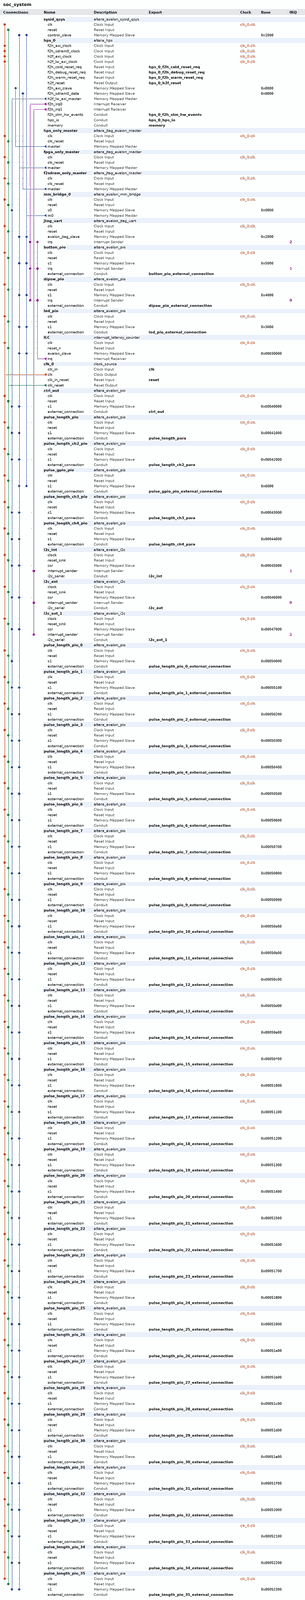
[diagram p0: system contents, whole]
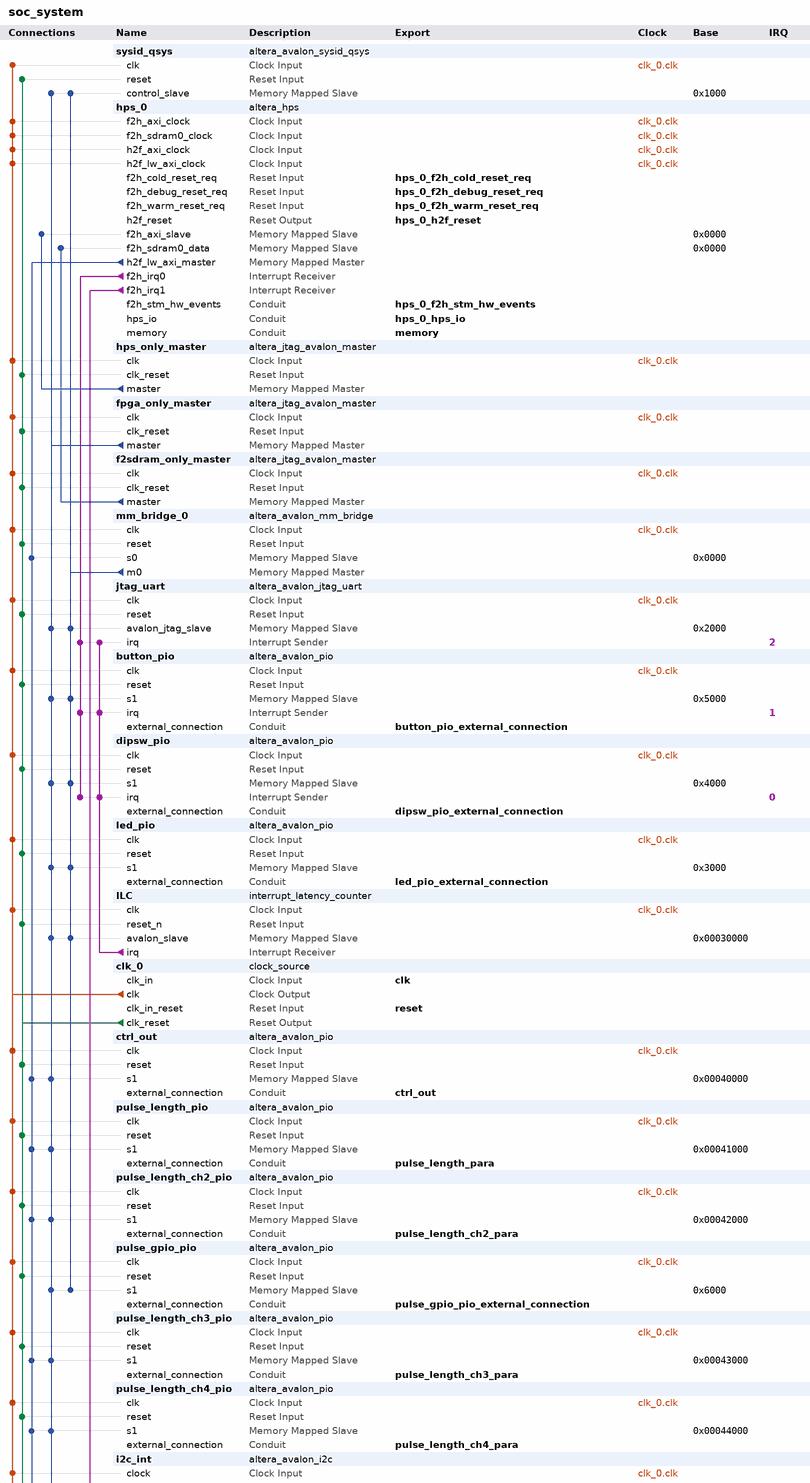
[diagram p1: system contents, upper part]
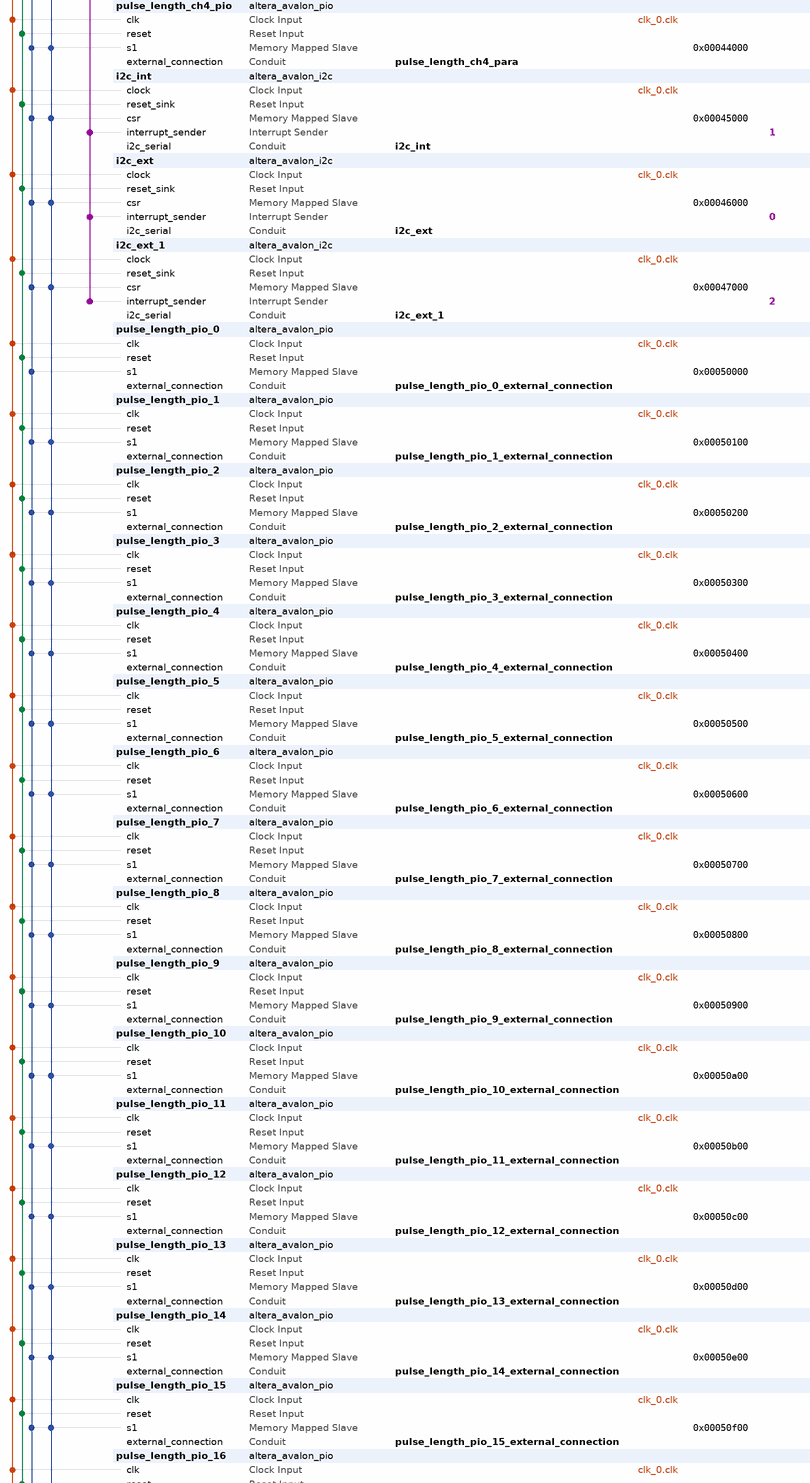
[diagram p2: system contents, middle part]
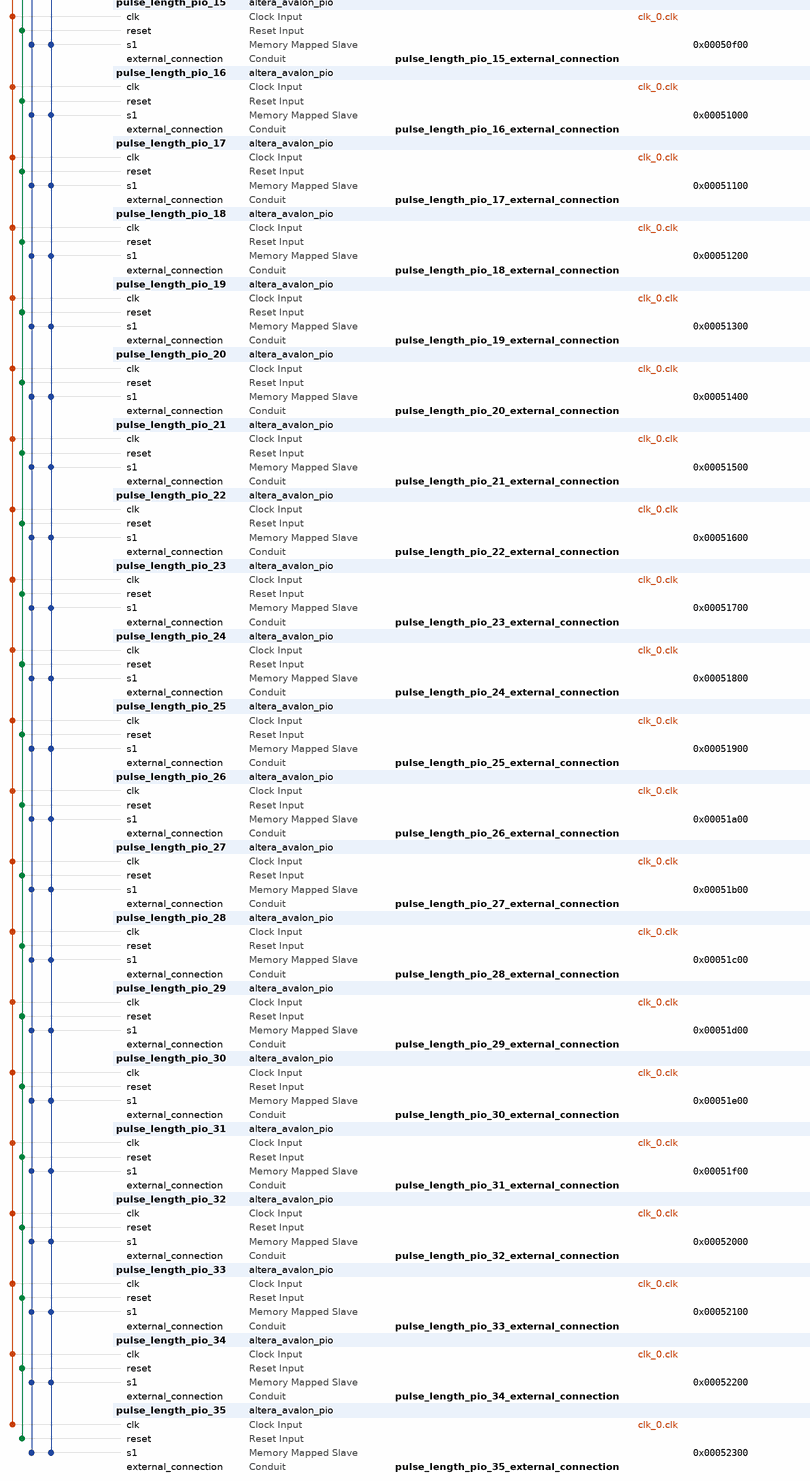
[diagram p3: system contents, lower part]
# Platform Designer (Qsys) system soc_system, Cyclone V 5CSEBA6U23I7
# Parameters at their usual value, and those the tool derives, are not listed.
package require -exact qsys 18.1
create_system soc_system
set_project_property DEVICE_FAMILY {Cyclone V}
set_project_property DEVICE 5CSEBA6U23I7

add_instance sysid_qsys altera_avalon_sysid_qsys 18.1
set_instance_parameter_value sysid_qsys id -1395322110

add_instance hps_0 altera_hps 18.1
set_instance_parameter_value hps_0 EMAC1_Mode RGMII
set_instance_parameter_value hps_0 EMAC1_PinMuxing {HPS I/O Set 0}
set_instance_parameter_value hps_0 F2SCLK_COLDRST_Enable true
set_instance_parameter_value hps_0 F2SCLK_DBGRST_Enable true
set_instance_parameter_value hps_0 F2SCLK_WARMRST_Enable true
set_instance_parameter_value hps_0 F2SDRAM_Type {Avalon-MM Bidirectional}
set_instance_parameter_value hps_0 F2SDRAM_Width 256
set_instance_parameter_value hps_0 F2SINTERRUPT_Enable true
set_instance_parameter_value hps_0 F2S_Width 2
set_instance_parameter_value hps_0 FPGA_PERIPHERAL_OUTPUT_CLOCK_FREQ_EMAC0_GTX_CLK 100
set_instance_parameter_value hps_0 FPGA_PERIPHERAL_OUTPUT_CLOCK_FREQ_EMAC0_MD_CLK 100.0
set_instance_parameter_value hps_0 FPGA_PERIPHERAL_OUTPUT_CLOCK_FREQ_EMAC1_GTX_CLK 100
set_instance_parameter_value hps_0 FPGA_PERIPHERAL_OUTPUT_CLOCK_FREQ_EMAC1_MD_CLK 100.0
set_instance_parameter_value hps_0 HPS_PROTOCOL DDR3
set_instance_parameter_value hps_0 I2C0_Mode I2C
set_instance_parameter_value hps_0 I2C0_PinMuxing {HPS I/O Set 0}
set_instance_parameter_value hps_0 I2C1_Mode I2C
set_instance_parameter_value hps_0 I2C1_PinMuxing {HPS I/O Set 0}
set_instance_parameter_value hps_0 LWH2F_Enable true
set_instance_parameter_value hps_0 MEM_BANKADDR_WIDTH 3
set_instance_parameter_value hps_0 MEM_CLK_FREQ 400.0
set_instance_parameter_value hps_0 MEM_COL_ADDR_WIDTH 10
set_instance_parameter_value hps_0 MEM_DQ_WIDTH 32
set_instance_parameter_value hps_0 MEM_DRV_STR RZQ/6
set_instance_parameter_value hps_0 MEM_ROW_ADDR_WIDTH 15
set_instance_parameter_value hps_0 MEM_RTT_NOM RZQ/6
set_instance_parameter_value hps_0 MEM_RTT_WR {Dynamic ODT off}
set_instance_parameter_value hps_0 MEM_TCL 7
set_instance_parameter_value hps_0 MEM_TFAW_NS 37.5
set_instance_parameter_value hps_0 MEM_TRAS_NS 35.0
set_instance_parameter_value hps_0 MEM_TRCD_NS 13.75
set_instance_parameter_value hps_0 MEM_TRFC_NS 300.0
set_instance_parameter_value hps_0 MEM_TRP_NS 13.75
set_instance_parameter_value hps_0 MEM_VENDOR Other
set_instance_parameter_value hps_0 MEM_WTCL 7
set_instance_parameter_value hps_0 QSPI_Mode N/A
set_instance_parameter_value hps_0 QSPI_PinMuxing Unused
set_instance_parameter_value hps_0 REF_CLK_FREQ 25.0
set_instance_parameter_value hps_0 S2FCLK_USER2CLK 4
set_instance_parameter_value hps_0 S2F_Width 2
set_instance_parameter_value hps_0 SDIO_Mode {4-bit Data}
set_instance_parameter_value hps_0 SDIO_PinMuxing {HPS I/O Set 0}
set_instance_parameter_value hps_0 SPIM1_Mode {Single Slave Select}
set_instance_parameter_value hps_0 SPIM1_PinMuxing {HPS I/O Set 0}
set_instance_parameter_value hps_0 STM_Enable true
set_instance_parameter_value hps_0 TIMING_BOARD_AC_SKEW 0.02
set_instance_parameter_value hps_0 TIMING_BOARD_AC_TO_CK_SKEW 0.0
set_instance_parameter_value hps_0 TIMING_BOARD_DQ_TO_DQS_SKEW 0.0
set_instance_parameter_value hps_0 TIMING_BOARD_MAX_CK_DELAY 0.6
set_instance_parameter_value hps_0 TIMING_BOARD_MAX_DQS_DELAY 0.6
set_instance_parameter_value hps_0 TIMING_BOARD_SKEW_BETWEEN_DQS 0.02
set_instance_parameter_value hps_0 TIMING_BOARD_SKEW_CKDQS_DIMM_MAX 0.01
set_instance_parameter_value hps_0 TIMING_BOARD_SKEW_CKDQS_DIMM_MIN -0.01
set_instance_parameter_value hps_0 TIMING_BOARD_SKEW_WITHIN_DQS 0.02
set_instance_parameter_value hps_0 TIMING_TDH 125
set_instance_parameter_value hps_0 TIMING_TDQSCK 400
set_instance_parameter_value hps_0 TIMING_TDQSQ 120
set_instance_parameter_value hps_0 TIMING_TDS 50
set_instance_parameter_value hps_0 TIMING_TIH 250
set_instance_parameter_value hps_0 TIMING_TIS 175
set_instance_parameter_value hps_0 TIMING_TQSH 0.38
set_instance_parameter_value hps_0 UART0_Mode {No Flow Control}
set_instance_parameter_value hps_0 UART0_PinMuxing {HPS I/O Set 0}
set_instance_parameter_value hps_0 USB1_Mode SDR
set_instance_parameter_value hps_0 USB1_PinMuxing {HPS I/O Set 0}
set_instance_parameter_value hps_0 desired_cfg_clk_mhz 100.0
set_instance_parameter_value hps_0 desired_qspi_clk_mhz 370.0

add_instance hps_only_master altera_jtag_avalon_master 18.1

add_instance fpga_only_master altera_jtag_avalon_master 18.1

add_instance f2sdram_only_master altera_jtag_avalon_master 18.1

add_instance mm_bridge_0 altera_avalon_mm_bridge 18.1
set_instance_parameter_value mm_bridge_0 ADDRESS_UNITS SYMBOLS
set_instance_parameter_value mm_bridge_0 ADDRESS_WIDTH 10
set_instance_parameter_value mm_bridge_0 DATA_WIDTH 32
set_instance_parameter_value mm_bridge_0 MAX_PENDING_RESPONSES 4
set_instance_parameter_value mm_bridge_0 USE_AUTO_ADDRESS_WIDTH 1

add_instance jtag_uart altera_avalon_jtag_uart 18.1
set_instance_parameter_value jtag_uart allowMultipleConnections true
set_instance_parameter_value jtag_uart simInteractiveOptions INTERACTIVE_ASCII_OUTPUT

add_instance button_pio altera_avalon_pio 18.1
set_instance_parameter_value button_pio bitClearingEdgeCapReg true
set_instance_parameter_value button_pio captureEdge true
set_instance_parameter_value button_pio direction Input
set_instance_parameter_value button_pio edgeType FALLING
set_instance_parameter_value button_pio generateIRQ true
set_instance_parameter_value button_pio irqType EDGE
set_instance_parameter_value button_pio width 2

add_instance dipsw_pio altera_avalon_pio 18.1
set_instance_parameter_value dipsw_pio bitClearingEdgeCapReg true
set_instance_parameter_value dipsw_pio captureEdge true
set_instance_parameter_value dipsw_pio direction Input
set_instance_parameter_value dipsw_pio edgeType ANY
set_instance_parameter_value dipsw_pio generateIRQ true
set_instance_parameter_value dipsw_pio irqType EDGE
set_instance_parameter_value dipsw_pio width 4

add_instance led_pio altera_avalon_pio 18.1
set_instance_parameter_value led_pio direction Output
set_instance_parameter_value led_pio resetValue 127
set_instance_parameter_value led_pio width 7

add_instance ILC interrupt_latency_counter 18.1

add_instance clk_0 clock_source 18.1
set_instance_parameter_value clk_0 clockFrequency 50000000

add_instance ctrl_out altera_avalon_pio 18.1
set_instance_parameter_value ctrl_out direction Output
set_instance_parameter_value ctrl_out width 32

add_instance pulse_length_pio altera_avalon_pio 18.1
set_instance_parameter_value pulse_length_pio direction Output
set_instance_parameter_value pulse_length_pio width 32

add_instance pulse_length_ch2_pio altera_avalon_pio 18.1
set_instance_parameter_value pulse_length_ch2_pio direction Output
set_instance_parameter_value pulse_length_ch2_pio width 32

add_instance pulse_gpio_pio altera_avalon_pio 18.1
set_instance_parameter_value pulse_gpio_pio direction Output
set_instance_parameter_value pulse_gpio_pio resetValue 127
set_instance_parameter_value pulse_gpio_pio width 7

add_instance pulse_length_ch3_pio altera_avalon_pio 18.1
set_instance_parameter_value pulse_length_ch3_pio direction Output
set_instance_parameter_value pulse_length_ch3_pio width 32

add_instance pulse_length_ch4_pio altera_avalon_pio 18.1
set_instance_parameter_value pulse_length_ch4_pio direction Output
set_instance_parameter_value pulse_length_ch4_pio width 32

add_instance i2c_int altera_avalon_i2c 18.1
set_instance_parameter_value i2c_int FIFO_DEPTH 32

add_instance i2c_ext altera_avalon_i2c 18.1
set_instance_parameter_value i2c_ext FIFO_DEPTH 32

add_instance i2c_ext_1 altera_avalon_i2c 18.1
set_instance_parameter_value i2c_ext_1 FIFO_DEPTH 32

add_instance pulse_length_pio_0 altera_avalon_pio 18.1
set_instance_parameter_value pulse_length_pio_0 direction Output
set_instance_parameter_value pulse_length_pio_0 width 32

add_instance pulse_length_pio_1 altera_avalon_pio 18.1
set_instance_parameter_value pulse_length_pio_1 direction Output
set_instance_parameter_value pulse_length_pio_1 width 32

add_instance pulse_length_pio_2 altera_avalon_pio 18.1
set_instance_parameter_value pulse_length_pio_2 direction Output
set_instance_parameter_value pulse_length_pio_2 width 32

add_instance pulse_length_pio_3 altera_avalon_pio 18.1
set_instance_parameter_value pulse_length_pio_3 direction Output
set_instance_parameter_value pulse_length_pio_3 width 32

add_instance pulse_length_pio_4 altera_avalon_pio 18.1
set_instance_parameter_value pulse_length_pio_4 direction Output
set_instance_parameter_value pulse_length_pio_4 width 32

add_instance pulse_length_pio_5 altera_avalon_pio 18.1
set_instance_parameter_value pulse_length_pio_5 direction Output
set_instance_parameter_value pulse_length_pio_5 width 32

add_instance pulse_length_pio_6 altera_avalon_pio 18.1
set_instance_parameter_value pulse_length_pio_6 direction Output
set_instance_parameter_value pulse_length_pio_6 width 32

add_instance pulse_length_pio_7 altera_avalon_pio 18.1
set_instance_parameter_value pulse_length_pio_7 direction Output
set_instance_parameter_value pulse_length_pio_7 width 32

add_instance pulse_length_pio_8 altera_avalon_pio 18.1
set_instance_parameter_value pulse_length_pio_8 direction Output
set_instance_parameter_value pulse_length_pio_8 width 32

add_instance pulse_length_pio_9 altera_avalon_pio 18.1
set_instance_parameter_value pulse_length_pio_9 direction Output
set_instance_parameter_value pulse_length_pio_9 width 32

add_instance pulse_length_pio_10 altera_avalon_pio 18.1
set_instance_parameter_value pulse_length_pio_10 direction Output
set_instance_parameter_value pulse_length_pio_10 width 32

add_instance pulse_length_pio_11 altera_avalon_pio 18.1
set_instance_parameter_value pulse_length_pio_11 direction Output
set_instance_parameter_value pulse_length_pio_11 width 32

add_instance pulse_length_pio_12 altera_avalon_pio 18.1
set_instance_parameter_value pulse_length_pio_12 direction Output
set_instance_parameter_value pulse_length_pio_12 width 32

add_instance pulse_length_pio_13 altera_avalon_pio 18.1
set_instance_parameter_value pulse_length_pio_13 direction Output
set_instance_parameter_value pulse_length_pio_13 width 32

add_instance pulse_length_pio_14 altera_avalon_pio 18.1
set_instance_parameter_value pulse_length_pio_14 direction Output
set_instance_parameter_value pulse_length_pio_14 width 32

add_instance pulse_length_pio_15 altera_avalon_pio 18.1
set_instance_parameter_value pulse_length_pio_15 direction Output
set_instance_parameter_value pulse_length_pio_15 width 32

add_instance pulse_length_pio_16 altera_avalon_pio 18.1
set_instance_parameter_value pulse_length_pio_16 direction Output
set_instance_parameter_value pulse_length_pio_16 width 32

add_instance pulse_length_pio_17 altera_avalon_pio 18.1
set_instance_parameter_value pulse_length_pio_17 direction Output
set_instance_parameter_value pulse_length_pio_17 width 32

add_instance pulse_length_pio_18 altera_avalon_pio 18.1
set_instance_parameter_value pulse_length_pio_18 direction Output
set_instance_parameter_value pulse_length_pio_18 width 32

add_instance pulse_length_pio_19 altera_avalon_pio 18.1
set_instance_parameter_value pulse_length_pio_19 direction Output
set_instance_parameter_value pulse_length_pio_19 width 32

add_instance pulse_length_pio_20 altera_avalon_pio 18.1
set_instance_parameter_value pulse_length_pio_20 direction Output
set_instance_parameter_value pulse_length_pio_20 width 32

add_instance pulse_length_pio_21 altera_avalon_pio 18.1
set_instance_parameter_value pulse_length_pio_21 direction Output
set_instance_parameter_value pulse_length_pio_21 width 32

add_instance pulse_length_pio_22 altera_avalon_pio 18.1
set_instance_parameter_value pulse_length_pio_22 direction Output
set_instance_parameter_value pulse_length_pio_22 width 32

add_instance pulse_length_pio_23 altera_avalon_pio 18.1
set_instance_parameter_value pulse_length_pio_23 direction Output
set_instance_parameter_value pulse_length_pio_23 width 32

add_instance pulse_length_pio_24 altera_avalon_pio 18.1
set_instance_parameter_value pulse_length_pio_24 direction Output
set_instance_parameter_value pulse_length_pio_24 width 32

add_instance pulse_length_pio_25 altera_avalon_pio 18.1
set_instance_parameter_value pulse_length_pio_25 direction Output
set_instance_parameter_value pulse_length_pio_25 width 32

add_instance pulse_length_pio_26 altera_avalon_pio 18.1
set_instance_parameter_value pulse_length_pio_26 direction Output
set_instance_parameter_value pulse_length_pio_26 width 32

add_instance pulse_length_pio_27 altera_avalon_pio 18.1
set_instance_parameter_value pulse_length_pio_27 direction Output
set_instance_parameter_value pulse_length_pio_27 width 32

add_instance pulse_length_pio_28 altera_avalon_pio 18.1
set_instance_parameter_value pulse_length_pio_28 direction Output
set_instance_parameter_value pulse_length_pio_28 width 32

add_instance pulse_length_pio_29 altera_avalon_pio 18.1
set_instance_parameter_value pulse_length_pio_29 direction Output
set_instance_parameter_value pulse_length_pio_29 width 32

add_instance pulse_length_pio_30 altera_avalon_pio 18.1
set_instance_parameter_value pulse_length_pio_30 direction Output
set_instance_parameter_value pulse_length_pio_30 width 32

add_instance pulse_length_pio_31 altera_avalon_pio 18.1
set_instance_parameter_value pulse_length_pio_31 direction Output
set_instance_parameter_value pulse_length_pio_31 width 32

add_instance pulse_length_pio_32 altera_avalon_pio 18.1
set_instance_parameter_value pulse_length_pio_32 direction Output
set_instance_parameter_value pulse_length_pio_32 width 32

add_instance pulse_length_pio_33 altera_avalon_pio 18.1
set_instance_parameter_value pulse_length_pio_33 direction Output
set_instance_parameter_value pulse_length_pio_33 width 32

add_instance pulse_length_pio_34 altera_avalon_pio 18.1
set_instance_parameter_value pulse_length_pio_34 direction Output
set_instance_parameter_value pulse_length_pio_34 width 32

add_instance pulse_length_pio_35 altera_avalon_pio 18.1
set_instance_parameter_value pulse_length_pio_35 direction Output
set_instance_parameter_value pulse_length_pio_35 width 32

# connections
add_connection clk_0.clk button_pio.clk clock
add_connection clk_0.clk ctrl_out.clk clock
add_connection clk_0.clk dipsw_pio.clk clock
add_connection clk_0.clk f2sdram_only_master.clk clock
add_connection clk_0.clk fpga_only_master.clk clock
add_connection clk_0.clk hps_0.f2h_axi_clock clock
add_connection clk_0.clk hps_0.f2h_sdram0_clock clock
add_connection clk_0.clk hps_0.h2f_axi_clock clock
add_connection clk_0.clk hps_0.h2f_lw_axi_clock clock
add_connection clk_0.clk hps_only_master.clk clock
add_connection clk_0.clk i2c_ext.clock clock
add_connection clk_0.clk i2c_ext_1.clock clock
add_connection clk_0.clk i2c_int.clock clock
add_connection clk_0.clk ILC.clk clock
add_connection clk_0.clk jtag_uart.clk clock
add_connection clk_0.clk led_pio.clk clock
add_connection clk_0.clk mm_bridge_0.clk clock
add_connection clk_0.clk pulse_gpio_pio.clk clock
add_connection clk_0.clk pulse_length_ch2_pio.clk clock
add_connection clk_0.clk pulse_length_ch3_pio.clk clock
add_connection clk_0.clk pulse_length_ch4_pio.clk clock
add_connection clk_0.clk pulse_length_pio.clk clock
add_connection clk_0.clk pulse_length_pio_0.clk clock
add_connection clk_0.clk pulse_length_pio_1.clk clock
add_connection clk_0.clk pulse_length_pio_2.clk clock
add_connection clk_0.clk pulse_length_pio_3.clk clock
add_connection clk_0.clk pulse_length_pio_4.clk clock
add_connection clk_0.clk pulse_length_pio_5.clk clock
add_connection clk_0.clk pulse_length_pio_6.clk clock
add_connection clk_0.clk pulse_length_pio_7.clk clock
add_connection clk_0.clk pulse_length_pio_8.clk clock
add_connection clk_0.clk pulse_length_pio_9.clk clock
add_connection clk_0.clk pulse_length_pio_10.clk clock
add_connection clk_0.clk pulse_length_pio_11.clk clock
add_connection clk_0.clk pulse_length_pio_12.clk clock
add_connection clk_0.clk pulse_length_pio_13.clk clock
add_connection clk_0.clk pulse_length_pio_14.clk clock
add_connection clk_0.clk pulse_length_pio_15.clk clock
add_connection clk_0.clk pulse_length_pio_16.clk clock
add_connection clk_0.clk pulse_length_pio_17.clk clock
add_connection clk_0.clk pulse_length_pio_18.clk clock
add_connection clk_0.clk pulse_length_pio_19.clk clock
add_connection clk_0.clk pulse_length_pio_20.clk clock
add_connection clk_0.clk pulse_length_pio_21.clk clock
add_connection clk_0.clk pulse_length_pio_22.clk clock
add_connection clk_0.clk pulse_length_pio_23.clk clock
add_connection clk_0.clk pulse_length_pio_24.clk clock
add_connection clk_0.clk pulse_length_pio_25.clk clock
add_connection clk_0.clk pulse_length_pio_26.clk clock
add_connection clk_0.clk pulse_length_pio_27.clk clock
add_connection clk_0.clk pulse_length_pio_28.clk clock
add_connection clk_0.clk pulse_length_pio_29.clk clock
add_connection clk_0.clk pulse_length_pio_30.clk clock
add_connection clk_0.clk pulse_length_pio_31.clk clock
add_connection clk_0.clk pulse_length_pio_32.clk clock
add_connection clk_0.clk pulse_length_pio_33.clk clock
add_connection clk_0.clk pulse_length_pio_34.clk clock
add_connection clk_0.clk pulse_length_pio_35.clk clock
add_connection clk_0.clk sysid_qsys.clk clock
add_connection clk_0.clk_reset button_pio.reset reset
add_connection clk_0.clk_reset ctrl_out.reset reset
add_connection clk_0.clk_reset dipsw_pio.reset reset
add_connection clk_0.clk_reset f2sdram_only_master.clk_reset reset
add_connection clk_0.clk_reset fpga_only_master.clk_reset reset
add_connection clk_0.clk_reset hps_only_master.clk_reset reset
add_connection clk_0.clk_reset i2c_ext.reset_sink reset
add_connection clk_0.clk_reset i2c_ext_1.reset_sink reset
add_connection clk_0.clk_reset i2c_int.reset_sink reset
add_connection clk_0.clk_reset ILC.reset_n reset
add_connection clk_0.clk_reset jtag_uart.reset reset
add_connection clk_0.clk_reset led_pio.reset reset
add_connection clk_0.clk_reset mm_bridge_0.reset reset
add_connection clk_0.clk_reset pulse_gpio_pio.reset reset
add_connection clk_0.clk_reset pulse_length_ch2_pio.reset reset
add_connection clk_0.clk_reset pulse_length_ch3_pio.reset reset
add_connection clk_0.clk_reset pulse_length_ch4_pio.reset reset
add_connection clk_0.clk_reset pulse_length_pio.reset reset
add_connection clk_0.clk_reset pulse_length_pio_0.reset reset
add_connection clk_0.clk_reset pulse_length_pio_1.reset reset
add_connection clk_0.clk_reset pulse_length_pio_2.reset reset
add_connection clk_0.clk_reset pulse_length_pio_3.reset reset
add_connection clk_0.clk_reset pulse_length_pio_4.reset reset
add_connection clk_0.clk_reset pulse_length_pio_5.reset reset
add_connection clk_0.clk_reset pulse_length_pio_6.reset reset
add_connection clk_0.clk_reset pulse_length_pio_7.reset reset
add_connection clk_0.clk_reset pulse_length_pio_8.reset reset
add_connection clk_0.clk_reset pulse_length_pio_9.reset reset
add_connection clk_0.clk_reset pulse_length_pio_10.reset reset
add_connection clk_0.clk_reset pulse_length_pio_11.reset reset
add_connection clk_0.clk_reset pulse_length_pio_12.reset reset
add_connection clk_0.clk_reset pulse_length_pio_13.reset reset
add_connection clk_0.clk_reset pulse_length_pio_14.reset reset
add_connection clk_0.clk_reset pulse_length_pio_15.reset reset
add_connection clk_0.clk_reset pulse_length_pio_16.reset reset
add_connection clk_0.clk_reset pulse_length_pio_17.reset reset
add_connection clk_0.clk_reset pulse_length_pio_18.reset reset
add_connection clk_0.clk_reset pulse_length_pio_19.reset reset
add_connection clk_0.clk_reset pulse_length_pio_20.reset reset
add_connection clk_0.clk_reset pulse_length_pio_21.reset reset
add_connection clk_0.clk_reset pulse_length_pio_22.reset reset
add_connection clk_0.clk_reset pulse_length_pio_23.reset reset
add_connection clk_0.clk_reset pulse_length_pio_24.reset reset
add_connection clk_0.clk_reset pulse_length_pio_25.reset reset
add_connection clk_0.clk_reset pulse_length_pio_26.reset reset
add_connection clk_0.clk_reset pulse_length_pio_27.reset reset
add_connection clk_0.clk_reset pulse_length_pio_28.reset reset
add_connection clk_0.clk_reset pulse_length_pio_29.reset reset
add_connection clk_0.clk_reset pulse_length_pio_30.reset reset
add_connection clk_0.clk_reset pulse_length_pio_31.reset reset
add_connection clk_0.clk_reset pulse_length_pio_32.reset reset
add_connection clk_0.clk_reset pulse_length_pio_33.reset reset
add_connection clk_0.clk_reset pulse_length_pio_34.reset reset
add_connection clk_0.clk_reset pulse_length_pio_35.reset reset
add_connection clk_0.clk_reset sysid_qsys.reset reset
add_connection f2sdram_only_master.master hps_0.f2h_sdram0_data avalon
set_connection_parameter_value f2sdram_only_master.master/hps_0.f2h_sdram0_data baseAddress 0x0000
add_connection fpga_only_master.master button_pio.s1 avalon
set_connection_parameter_value fpga_only_master.master/button_pio.s1 baseAddress 0x5000
add_connection fpga_only_master.master ctrl_out.s1 avalon
set_connection_parameter_value fpga_only_master.master/ctrl_out.s1 baseAddress 0x00040000
add_connection fpga_only_master.master dipsw_pio.s1 avalon
set_connection_parameter_value fpga_only_master.master/dipsw_pio.s1 baseAddress 0x4000
add_connection fpga_only_master.master i2c_ext.csr avalon
set_connection_parameter_value fpga_only_master.master/i2c_ext.csr baseAddress 0x00046000
add_connection fpga_only_master.master i2c_ext_1.csr avalon
set_connection_parameter_value fpga_only_master.master/i2c_ext_1.csr baseAddress 0x00047000
add_connection fpga_only_master.master i2c_int.csr avalon
set_connection_parameter_value fpga_only_master.master/i2c_int.csr baseAddress 0x00045000
add_connection fpga_only_master.master ILC.avalon_slave avalon
set_connection_parameter_value fpga_only_master.master/ILC.avalon_slave baseAddress 0x00030000
add_connection fpga_only_master.master jtag_uart.avalon_jtag_slave avalon
set_connection_parameter_value fpga_only_master.master/jtag_uart.avalon_jtag_slave baseAddress 0x2000
add_connection fpga_only_master.master led_pio.s1 avalon
set_connection_parameter_value fpga_only_master.master/led_pio.s1 baseAddress 0x3000
add_connection fpga_only_master.master pulse_gpio_pio.s1 avalon
set_connection_parameter_value fpga_only_master.master/pulse_gpio_pio.s1 baseAddress 0x6000
add_connection fpga_only_master.master pulse_length_ch2_pio.s1 avalon
set_connection_parameter_value fpga_only_master.master/pulse_length_ch2_pio.s1 baseAddress 0x00042000
add_connection fpga_only_master.master pulse_length_ch3_pio.s1 avalon
set_connection_parameter_value fpga_only_master.master/pulse_length_ch3_pio.s1 baseAddress 0x00043000
add_connection fpga_only_master.master pulse_length_ch4_pio.s1 avalon
set_connection_parameter_value fpga_only_master.master/pulse_length_ch4_pio.s1 baseAddress 0x00044000
add_connection fpga_only_master.master pulse_length_pio.s1 avalon
set_connection_parameter_value fpga_only_master.master/pulse_length_pio.s1 baseAddress 0x00041000
add_connection fpga_only_master.master pulse_length_pio_1.s1 avalon
set_connection_parameter_value fpga_only_master.master/pulse_length_pio_1.s1 baseAddress 0x00050100
add_connection fpga_only_master.master pulse_length_pio_2.s1 avalon
set_connection_parameter_value fpga_only_master.master/pulse_length_pio_2.s1 baseAddress 0x00050200
add_connection fpga_only_master.master pulse_length_pio_3.s1 avalon
set_connection_parameter_value fpga_only_master.master/pulse_length_pio_3.s1 baseAddress 0x00050300
add_connection fpga_only_master.master pulse_length_pio_4.s1 avalon
set_connection_parameter_value fpga_only_master.master/pulse_length_pio_4.s1 baseAddress 0x00050400
add_connection fpga_only_master.master pulse_length_pio_5.s1 avalon
set_connection_parameter_value fpga_only_master.master/pulse_length_pio_5.s1 baseAddress 0x00050500
add_connection fpga_only_master.master pulse_length_pio_6.s1 avalon
set_connection_parameter_value fpga_only_master.master/pulse_length_pio_6.s1 baseAddress 0x00050600
add_connection fpga_only_master.master pulse_length_pio_7.s1 avalon
set_connection_parameter_value fpga_only_master.master/pulse_length_pio_7.s1 baseAddress 0x00050700
add_connection fpga_only_master.master pulse_length_pio_8.s1 avalon
set_connection_parameter_value fpga_only_master.master/pulse_length_pio_8.s1 baseAddress 0x00050800
add_connection fpga_only_master.master pulse_length_pio_9.s1 avalon
set_connection_parameter_value fpga_only_master.master/pulse_length_pio_9.s1 baseAddress 0x00050900
add_connection fpga_only_master.master pulse_length_pio_10.s1 avalon
set_connection_parameter_value fpga_only_master.master/pulse_length_pio_10.s1 baseAddress 0x00050a00
add_connection fpga_only_master.master pulse_length_pio_11.s1 avalon
set_connection_parameter_value fpga_only_master.master/pulse_length_pio_11.s1 baseAddress 0x00050b00
add_connection fpga_only_master.master pulse_length_pio_12.s1 avalon
set_connection_parameter_value fpga_only_master.master/pulse_length_pio_12.s1 baseAddress 0x00050c00
add_connection fpga_only_master.master pulse_length_pio_13.s1 avalon
set_connection_parameter_value fpga_only_master.master/pulse_length_pio_13.s1 baseAddress 0x00050d00
add_connection fpga_only_master.master pulse_length_pio_14.s1 avalon
set_connection_parameter_value fpga_only_master.master/pulse_length_pio_14.s1 baseAddress 0x00050e00
add_connection fpga_only_master.master pulse_length_pio_15.s1 avalon
set_connection_parameter_value fpga_only_master.master/pulse_length_pio_15.s1 baseAddress 0x00050f00
add_connection fpga_only_master.master pulse_length_pio_16.s1 avalon
set_connection_parameter_value fpga_only_master.master/pulse_length_pio_16.s1 baseAddress 0x00051000
add_connection fpga_only_master.master pulse_length_pio_17.s1 avalon
set_connection_parameter_value fpga_only_master.master/pulse_length_pio_17.s1 baseAddress 0x00051100
add_connection fpga_only_master.master pulse_length_pio_18.s1 avalon
set_connection_parameter_value fpga_only_master.master/pulse_length_pio_18.s1 baseAddress 0x00051200
add_connection fpga_only_master.master pulse_length_pio_19.s1 avalon
set_connection_parameter_value fpga_only_master.master/pulse_length_pio_19.s1 baseAddress 0x00051300
add_connection fpga_only_master.master pulse_length_pio_20.s1 avalon
set_connection_parameter_value fpga_only_master.master/pulse_length_pio_20.s1 baseAddress 0x00051400
add_connection fpga_only_master.master pulse_length_pio_21.s1 avalon
set_connection_parameter_value fpga_only_master.master/pulse_length_pio_21.s1 baseAddress 0x00051500
add_connection fpga_only_master.master pulse_length_pio_22.s1 avalon
set_connection_parameter_value fpga_only_master.master/pulse_length_pio_22.s1 baseAddress 0x00051600
add_connection fpga_only_master.master pulse_length_pio_23.s1 avalon
set_connection_parameter_value fpga_only_master.master/pulse_length_pio_23.s1 baseAddress 0x00051700
add_connection fpga_only_master.master pulse_length_pio_24.s1 avalon
set_connection_parameter_value fpga_only_master.master/pulse_length_pio_24.s1 baseAddress 0x00051800
add_connection fpga_only_master.master pulse_length_pio_25.s1 avalon
set_connection_parameter_value fpga_only_master.master/pulse_length_pio_25.s1 baseAddress 0x00051900
add_connection fpga_only_master.master pulse_length_pio_26.s1 avalon
set_connection_parameter_value fpga_only_master.master/pulse_length_pio_26.s1 baseAddress 0x00051a00
add_connection fpga_only_master.master pulse_length_pio_27.s1 avalon
set_connection_parameter_value fpga_only_master.master/pulse_length_pio_27.s1 baseAddress 0x00051b00
add_connection fpga_only_master.master pulse_length_pio_28.s1 avalon
set_connection_parameter_value fpga_only_master.master/pulse_length_pio_28.s1 baseAddress 0x00051c00
add_connection fpga_only_master.master pulse_length_pio_29.s1 avalon
set_connection_parameter_value fpga_only_master.master/pulse_length_pio_29.s1 baseAddress 0x00051d00
add_connection fpga_only_master.master pulse_length_pio_30.s1 avalon
set_connection_parameter_value fpga_only_master.master/pulse_length_pio_30.s1 baseAddress 0x00051e00
add_connection fpga_only_master.master pulse_length_pio_31.s1 avalon
set_connection_parameter_value fpga_only_master.master/pulse_length_pio_31.s1 baseAddress 0x00051f00
add_connection fpga_only_master.master pulse_length_pio_32.s1 avalon
set_connection_parameter_value fpga_only_master.master/pulse_length_pio_32.s1 baseAddress 0x00052000
add_connection fpga_only_master.master pulse_length_pio_33.s1 avalon
set_connection_parameter_value fpga_only_master.master/pulse_length_pio_33.s1 baseAddress 0x00052100
add_connection fpga_only_master.master pulse_length_pio_34.s1 avalon
set_connection_parameter_value fpga_only_master.master/pulse_length_pio_34.s1 baseAddress 0x00052200
add_connection fpga_only_master.master pulse_length_pio_35.s1 avalon
set_connection_parameter_value fpga_only_master.master/pulse_length_pio_35.s1 baseAddress 0x00052300
add_connection fpga_only_master.master sysid_qsys.control_slave avalon
set_connection_parameter_value fpga_only_master.master/sysid_qsys.control_slave baseAddress 0x1000
add_connection hps_0.h2f_lw_axi_master ctrl_out.s1 avalon
set_connection_parameter_value hps_0.h2f_lw_axi_master/ctrl_out.s1 baseAddress 0x00040000
add_connection hps_0.h2f_lw_axi_master i2c_ext.csr avalon
set_connection_parameter_value hps_0.h2f_lw_axi_master/i2c_ext.csr baseAddress 0x00046000
add_connection hps_0.h2f_lw_axi_master i2c_ext_1.csr avalon
set_connection_parameter_value hps_0.h2f_lw_axi_master/i2c_ext_1.csr baseAddress 0x00047000
add_connection hps_0.h2f_lw_axi_master i2c_int.csr avalon
set_connection_parameter_value hps_0.h2f_lw_axi_master/i2c_int.csr baseAddress 0x00045000
add_connection hps_0.h2f_lw_axi_master mm_bridge_0.s0 avalon
set_connection_parameter_value hps_0.h2f_lw_axi_master/mm_bridge_0.s0 baseAddress 0x0000
add_connection hps_0.h2f_lw_axi_master pulse_length_ch2_pio.s1 avalon
set_connection_parameter_value hps_0.h2f_lw_axi_master/pulse_length_ch2_pio.s1 baseAddress 0x00042000
add_connection hps_0.h2f_lw_axi_master pulse_length_ch3_pio.s1 avalon
set_connection_parameter_value hps_0.h2f_lw_axi_master/pulse_length_ch3_pio.s1 baseAddress 0x00043000
add_connection hps_0.h2f_lw_axi_master pulse_length_ch4_pio.s1 avalon
set_connection_parameter_value hps_0.h2f_lw_axi_master/pulse_length_ch4_pio.s1 baseAddress 0x00044000
add_connection hps_0.h2f_lw_axi_master pulse_length_pio.s1 avalon
set_connection_parameter_value hps_0.h2f_lw_axi_master/pulse_length_pio.s1 baseAddress 0x00041000
add_connection hps_0.h2f_lw_axi_master pulse_length_pio_0.s1 avalon
set_connection_parameter_value hps_0.h2f_lw_axi_master/pulse_length_pio_0.s1 baseAddress 0x00050000
add_connection hps_0.h2f_lw_axi_master pulse_length_pio_1.s1 avalon
set_connection_parameter_value hps_0.h2f_lw_axi_master/pulse_length_pio_1.s1 baseAddress 0x00050100
add_connection hps_0.h2f_lw_axi_master pulse_length_pio_2.s1 avalon
set_connection_parameter_value hps_0.h2f_lw_axi_master/pulse_length_pio_2.s1 baseAddress 0x00050200
add_connection hps_0.h2f_lw_axi_master pulse_length_pio_3.s1 avalon
set_connection_parameter_value hps_0.h2f_lw_axi_master/pulse_length_pio_3.s1 baseAddress 0x00050300
add_connection hps_0.h2f_lw_axi_master pulse_length_pio_4.s1 avalon
set_connection_parameter_value hps_0.h2f_lw_axi_master/pulse_length_pio_4.s1 baseAddress 0x00050400
add_connection hps_0.h2f_lw_axi_master pulse_length_pio_5.s1 avalon
set_connection_parameter_value hps_0.h2f_lw_axi_master/pulse_length_pio_5.s1 baseAddress 0x00050500
add_connection hps_0.h2f_lw_axi_master pulse_length_pio_6.s1 avalon
set_connection_parameter_value hps_0.h2f_lw_axi_master/pulse_length_pio_6.s1 baseAddress 0x00050600
add_connection hps_0.h2f_lw_axi_master pulse_length_pio_7.s1 avalon
set_connection_parameter_value hps_0.h2f_lw_axi_master/pulse_length_pio_7.s1 baseAddress 0x00050700
add_connection hps_0.h2f_lw_axi_master pulse_length_pio_8.s1 avalon
set_connection_parameter_value hps_0.h2f_lw_axi_master/pulse_length_pio_8.s1 baseAddress 0x00050800
add_connection hps_0.h2f_lw_axi_master pulse_length_pio_9.s1 avalon
set_connection_parameter_value hps_0.h2f_lw_axi_master/pulse_length_pio_9.s1 baseAddress 0x00050900
add_connection hps_0.h2f_lw_axi_master pulse_length_pio_10.s1 avalon
set_connection_parameter_value hps_0.h2f_lw_axi_master/pulse_length_pio_10.s1 baseAddress 0x00050a00
add_connection hps_0.h2f_lw_axi_master pulse_length_pio_11.s1 avalon
set_connection_parameter_value hps_0.h2f_lw_axi_master/pulse_length_pio_11.s1 baseAddress 0x00050b00
add_connection hps_0.h2f_lw_axi_master pulse_length_pio_12.s1 avalon
set_connection_parameter_value hps_0.h2f_lw_axi_master/pulse_length_pio_12.s1 baseAddress 0x00050c00
add_connection hps_0.h2f_lw_axi_master pulse_length_pio_13.s1 avalon
set_connection_parameter_value hps_0.h2f_lw_axi_master/pulse_length_pio_13.s1 baseAddress 0x00050d00
add_connection hps_0.h2f_lw_axi_master pulse_length_pio_14.s1 avalon
set_connection_parameter_value hps_0.h2f_lw_axi_master/pulse_length_pio_14.s1 baseAddress 0x00050e00
add_connection hps_0.h2f_lw_axi_master pulse_length_pio_15.s1 avalon
set_connection_parameter_value hps_0.h2f_lw_axi_master/pulse_length_pio_15.s1 baseAddress 0x00050f00
add_connection hps_0.h2f_lw_axi_master pulse_length_pio_16.s1 avalon
set_connection_parameter_value hps_0.h2f_lw_axi_master/pulse_length_pio_16.s1 baseAddress 0x00051000
add_connection hps_0.h2f_lw_axi_master pulse_length_pio_17.s1 avalon
set_connection_parameter_value hps_0.h2f_lw_axi_master/pulse_length_pio_17.s1 baseAddress 0x00051100
add_connection hps_0.h2f_lw_axi_master pulse_length_pio_18.s1 avalon
set_connection_parameter_value hps_0.h2f_lw_axi_master/pulse_length_pio_18.s1 baseAddress 0x00051200
add_connection hps_0.h2f_lw_axi_master pulse_length_pio_19.s1 avalon
set_connection_parameter_value hps_0.h2f_lw_axi_master/pulse_length_pio_19.s1 baseAddress 0x00051300
add_connection hps_0.h2f_lw_axi_master pulse_length_pio_20.s1 avalon
set_connection_parameter_value hps_0.h2f_lw_axi_master/pulse_length_pio_20.s1 baseAddress 0x00051400
add_connection hps_0.h2f_lw_axi_master pulse_length_pio_21.s1 avalon
set_connection_parameter_value hps_0.h2f_lw_axi_master/pulse_length_pio_21.s1 baseAddress 0x00051500
add_connection hps_0.h2f_lw_axi_master pulse_length_pio_22.s1 avalon
set_connection_parameter_value hps_0.h2f_lw_axi_master/pulse_length_pio_22.s1 baseAddress 0x00051600
add_connection hps_0.h2f_lw_axi_master pulse_length_pio_23.s1 avalon
set_connection_parameter_value hps_0.h2f_lw_axi_master/pulse_length_pio_23.s1 baseAddress 0x00051700
add_connection hps_0.h2f_lw_axi_master pulse_length_pio_24.s1 avalon
set_connection_parameter_value hps_0.h2f_lw_axi_master/pulse_length_pio_24.s1 baseAddress 0x00051800
add_connection hps_0.h2f_lw_axi_master pulse_length_pio_25.s1 avalon
set_connection_parameter_value hps_0.h2f_lw_axi_master/pulse_length_pio_25.s1 baseAddress 0x00051900
add_connection hps_0.h2f_lw_axi_master pulse_length_pio_26.s1 avalon
set_connection_parameter_value hps_0.h2f_lw_axi_master/pulse_length_pio_26.s1 baseAddress 0x00051a00
add_connection hps_0.h2f_lw_axi_master pulse_length_pio_27.s1 avalon
set_connection_parameter_value hps_0.h2f_lw_axi_master/pulse_length_pio_27.s1 baseAddress 0x00051b00
add_connection hps_0.h2f_lw_axi_master pulse_length_pio_28.s1 avalon
set_connection_parameter_value hps_0.h2f_lw_axi_master/pulse_length_pio_28.s1 baseAddress 0x00051c00
add_connection hps_0.h2f_lw_axi_master pulse_length_pio_29.s1 avalon
set_connection_parameter_value hps_0.h2f_lw_axi_master/pulse_length_pio_29.s1 baseAddress 0x00051d00
add_connection hps_0.h2f_lw_axi_master pulse_length_pio_30.s1 avalon
set_connection_parameter_value hps_0.h2f_lw_axi_master/pulse_length_pio_30.s1 baseAddress 0x00051e00
add_connection hps_0.h2f_lw_axi_master pulse_length_pio_31.s1 avalon
set_connection_parameter_value hps_0.h2f_lw_axi_master/pulse_length_pio_31.s1 baseAddress 0x00051f00
add_connection hps_0.h2f_lw_axi_master pulse_length_pio_32.s1 avalon
set_connection_parameter_value hps_0.h2f_lw_axi_master/pulse_length_pio_32.s1 baseAddress 0x00052000
add_connection hps_0.h2f_lw_axi_master pulse_length_pio_33.s1 avalon
set_connection_parameter_value hps_0.h2f_lw_axi_master/pulse_length_pio_33.s1 baseAddress 0x00052100
add_connection hps_0.h2f_lw_axi_master pulse_length_pio_34.s1 avalon
set_connection_parameter_value hps_0.h2f_lw_axi_master/pulse_length_pio_34.s1 baseAddress 0x00052200
add_connection hps_0.h2f_lw_axi_master pulse_length_pio_35.s1 avalon
set_connection_parameter_value hps_0.h2f_lw_axi_master/pulse_length_pio_35.s1 baseAddress 0x00052300
add_connection hps_only_master.master hps_0.f2h_axi_slave avalon
set_connection_parameter_value hps_only_master.master/hps_0.f2h_axi_slave baseAddress 0x0000
add_connection mm_bridge_0.m0 button_pio.s1 avalon
set_connection_parameter_value mm_bridge_0.m0/button_pio.s1 baseAddress 0x5000
add_connection mm_bridge_0.m0 dipsw_pio.s1 avalon
set_connection_parameter_value mm_bridge_0.m0/dipsw_pio.s1 baseAddress 0x4000
add_connection mm_bridge_0.m0 ILC.avalon_slave avalon
set_connection_parameter_value mm_bridge_0.m0/ILC.avalon_slave baseAddress 0x00030000
add_connection mm_bridge_0.m0 jtag_uart.avalon_jtag_slave avalon
set_connection_parameter_value mm_bridge_0.m0/jtag_uart.avalon_jtag_slave baseAddress 0x2000
add_connection mm_bridge_0.m0 led_pio.s1 avalon
set_connection_parameter_value mm_bridge_0.m0/led_pio.s1 baseAddress 0x3000
add_connection mm_bridge_0.m0 pulse_gpio_pio.s1 avalon
set_connection_parameter_value mm_bridge_0.m0/pulse_gpio_pio.s1 baseAddress 0x6000
add_connection mm_bridge_0.m0 sysid_qsys.control_slave avalon
set_connection_parameter_value mm_bridge_0.m0/sysid_qsys.control_slave baseAddress 0x1000
add_connection hps_0.f2h_irq0 button_pio.irq interrupt
set_connection_parameter_value hps_0.f2h_irq0/button_pio.irq irqNumber 1
add_connection hps_0.f2h_irq0 dipsw_pio.irq interrupt
set_connection_parameter_value hps_0.f2h_irq0/dipsw_pio.irq irqNumber 0
add_connection hps_0.f2h_irq0 jtag_uart.irq interrupt
set_connection_parameter_value hps_0.f2h_irq0/jtag_uart.irq irqNumber 2
add_connection hps_0.f2h_irq1 i2c_ext.interrupt_sender interrupt
set_connection_parameter_value hps_0.f2h_irq1/i2c_ext.interrupt_sender irqNumber 0
add_connection hps_0.f2h_irq1 i2c_ext_1.interrupt_sender interrupt
set_connection_parameter_value hps_0.f2h_irq1/i2c_ext_1.interrupt_sender irqNumber 2
add_connection hps_0.f2h_irq1 i2c_int.interrupt_sender interrupt
set_connection_parameter_value hps_0.f2h_irq1/i2c_int.interrupt_sender irqNumber 1
add_connection ILC.irq button_pio.irq interrupt
set_connection_parameter_value ILC.irq/button_pio.irq irqNumber 1
add_connection ILC.irq dipsw_pio.irq interrupt
set_connection_parameter_value ILC.irq/dipsw_pio.irq irqNumber 0
add_connection ILC.irq jtag_uart.irq interrupt
set_connection_parameter_value ILC.irq/jtag_uart.irq irqNumber 2

# exported interfaces
add_interface button_pio_external_connection conduit end
set_interface_property button_pio_external_connection EXPORT_OF button_pio.external_connection
add_interface clk clock sink
set_interface_property clk EXPORT_OF clk_0.clk_in
add_interface ctrl_out conduit end
set_interface_property ctrl_out EXPORT_OF ctrl_out.external_connection
add_interface dipsw_pio_external_connection conduit end
set_interface_property dipsw_pio_external_connection EXPORT_OF dipsw_pio.external_connection
add_interface hps_0_f2h_cold_reset_req reset sink
set_interface_property hps_0_f2h_cold_reset_req EXPORT_OF hps_0.f2h_cold_reset_req
add_interface hps_0_f2h_debug_reset_req reset sink
set_interface_property hps_0_f2h_debug_reset_req EXPORT_OF hps_0.f2h_debug_reset_req
add_interface hps_0_f2h_stm_hw_events conduit end
set_interface_property hps_0_f2h_stm_hw_events EXPORT_OF hps_0.f2h_stm_hw_events
add_interface hps_0_f2h_warm_reset_req reset sink
set_interface_property hps_0_f2h_warm_reset_req EXPORT_OF hps_0.f2h_warm_reset_req
add_interface hps_0_h2f_reset reset source
set_interface_property hps_0_h2f_reset EXPORT_OF hps_0.h2f_reset
add_interface hps_0_hps_io conduit end
set_interface_property hps_0_hps_io EXPORT_OF hps_0.hps_io
add_interface i2c_ext conduit end
set_interface_property i2c_ext EXPORT_OF i2c_ext.i2c_serial
add_interface i2c_ext_1 conduit end
set_interface_property i2c_ext_1 EXPORT_OF i2c_ext_1.i2c_serial
add_interface i2c_int conduit end
set_interface_property i2c_int EXPORT_OF i2c_int.i2c_serial
add_interface led_pio_external_connection conduit end
set_interface_property led_pio_external_connection EXPORT_OF led_pio.external_connection
add_interface memory conduit end
set_interface_property memory EXPORT_OF hps_0.memory
add_interface pulse_gpio_pio_external_connection conduit end
set_interface_property pulse_gpio_pio_external_connection EXPORT_OF pulse_gpio_pio.external_connection
add_interface pulse_length_ch2_para conduit end
set_interface_property pulse_length_ch2_para EXPORT_OF pulse_length_ch2_pio.external_connection
add_interface pulse_length_ch3_para conduit end
set_interface_property pulse_length_ch3_para EXPORT_OF pulse_length_ch3_pio.external_connection
add_interface pulse_length_ch4_para conduit end
set_interface_property pulse_length_ch4_para EXPORT_OF pulse_length_ch4_pio.external_connection
add_interface pulse_length_para conduit end
set_interface_property pulse_length_para EXPORT_OF pulse_length_pio.external_connection
add_interface pulse_length_pio_0_external_connection conduit end
set_interface_property pulse_length_pio_0_external_connection EXPORT_OF pulse_length_pio_0.external_connection
add_interface pulse_length_pio_10_external_connection conduit end
set_interface_property pulse_length_pio_10_external_connection EXPORT_OF pulse_length_pio_10.external_connection
add_interface pulse_length_pio_11_external_connection conduit end
set_interface_property pulse_length_pio_11_external_connection EXPORT_OF pulse_length_pio_11.external_connection
add_interface pulse_length_pio_12_external_connection conduit end
set_interface_property pulse_length_pio_12_external_connection EXPORT_OF pulse_length_pio_12.external_connection
add_interface pulse_length_pio_13_external_connection conduit end
set_interface_property pulse_length_pio_13_external_connection EXPORT_OF pulse_length_pio_13.external_connection
add_interface pulse_length_pio_14_external_connection conduit end
set_interface_property pulse_length_pio_14_external_connection EXPORT_OF pulse_length_pio_14.external_connection
add_interface pulse_length_pio_15_external_connection conduit end
set_interface_property pulse_length_pio_15_external_connection EXPORT_OF pulse_length_pio_15.external_connection
add_interface pulse_length_pio_16_external_connection conduit end
set_interface_property pulse_length_pio_16_external_connection EXPORT_OF pulse_length_pio_16.external_connection
add_interface pulse_length_pio_17_external_connection conduit end
set_interface_property pulse_length_pio_17_external_connection EXPORT_OF pulse_length_pio_17.external_connection
add_interface pulse_length_pio_18_external_connection conduit end
set_interface_property pulse_length_pio_18_external_connection EXPORT_OF pulse_length_pio_18.external_connection
add_interface pulse_length_pio_19_external_connection conduit end
set_interface_property pulse_length_pio_19_external_connection EXPORT_OF pulse_length_pio_19.external_connection
add_interface pulse_length_pio_1_external_connection conduit end
set_interface_property pulse_length_pio_1_external_connection EXPORT_OF pulse_length_pio_1.external_connection
add_interface pulse_length_pio_20_external_connection conduit end
set_interface_property pulse_length_pio_20_external_connection EXPORT_OF pulse_length_pio_20.external_connection
add_interface pulse_length_pio_21_external_connection conduit end
set_interface_property pulse_length_pio_21_external_connection EXPORT_OF pulse_length_pio_21.external_connection
add_interface pulse_length_pio_22_external_connection conduit end
set_interface_property pulse_length_pio_22_external_connection EXPORT_OF pulse_length_pio_22.external_connection
add_interface pulse_length_pio_23_external_connection conduit end
set_interface_property pulse_length_pio_23_external_connection EXPORT_OF pulse_length_pio_23.external_connection
add_interface pulse_length_pio_24_external_connection conduit end
set_interface_property pulse_length_pio_24_external_connection EXPORT_OF pulse_length_pio_24.external_connection
add_interface pulse_length_pio_25_external_connection conduit end
set_interface_property pulse_length_pio_25_external_connection EXPORT_OF pulse_length_pio_25.external_connection
add_interface pulse_length_pio_26_external_connection conduit end
set_interface_property pulse_length_pio_26_external_connection EXPORT_OF pulse_length_pio_26.external_connection
add_interface pulse_length_pio_27_external_connection conduit end
set_interface_property pulse_length_pio_27_external_connection EXPORT_OF pulse_length_pio_27.external_connection
add_interface pulse_length_pio_28_external_connection conduit end
set_interface_property pulse_length_pio_28_external_connection EXPORT_OF pulse_length_pio_28.external_connection
add_interface pulse_length_pio_29_external_connection conduit end
set_interface_property pulse_length_pio_29_external_connection EXPORT_OF pulse_length_pio_29.external_connection
add_interface pulse_length_pio_2_external_connection conduit end
set_interface_property pulse_length_pio_2_external_connection EXPORT_OF pulse_length_pio_2.external_connection
add_interface pulse_length_pio_30_external_connection conduit end
set_interface_property pulse_length_pio_30_external_connection EXPORT_OF pulse_length_pio_30.external_connection
add_interface pulse_length_pio_31_external_connection conduit end
set_interface_property pulse_length_pio_31_external_connection EXPORT_OF pulse_length_pio_31.external_connection
add_interface pulse_length_pio_32_external_connection conduit end
set_interface_property pulse_length_pio_32_external_connection EXPORT_OF pulse_length_pio_32.external_connection
add_interface pulse_length_pio_33_external_connection conduit end
set_interface_property pulse_length_pio_33_external_connection EXPORT_OF pulse_length_pio_33.external_connection
add_interface pulse_length_pio_34_external_connection conduit end
set_interface_property pulse_length_pio_34_external_connection EXPORT_OF pulse_length_pio_34.external_connection
add_interface pulse_length_pio_35_external_connection conduit end
set_interface_property pulse_length_pio_35_external_connection EXPORT_OF pulse_length_pio_35.external_connection
add_interface pulse_length_pio_3_external_connection conduit end
set_interface_property pulse_length_pio_3_external_connection EXPORT_OF pulse_length_pio_3.external_connection
add_interface pulse_length_pio_4_external_connection conduit end
set_interface_property pulse_length_pio_4_external_connection EXPORT_OF pulse_length_pio_4.external_connection
add_interface pulse_length_pio_5_external_connection conduit end
set_interface_property pulse_length_pio_5_external_connection EXPORT_OF pulse_length_pio_5.external_connection
add_interface pulse_length_pio_6_external_connection conduit end
set_interface_property pulse_length_pio_6_external_connection EXPORT_OF pulse_length_pio_6.external_connection
add_interface pulse_length_pio_7_external_connection conduit end
set_interface_property pulse_length_pio_7_external_connection EXPORT_OF pulse_length_pio_7.external_connection
add_interface pulse_length_pio_8_external_connection conduit end
set_interface_property pulse_length_pio_8_external_connection EXPORT_OF pulse_length_pio_8.external_connection
add_interface pulse_length_pio_9_external_connection conduit end
set_interface_property pulse_length_pio_9_external_connection EXPORT_OF pulse_length_pio_9.external_connection
add_interface reset reset sink
set_interface_property reset EXPORT_OF clk_0.clk_in_reset

set_interconnect_requirement {$system} qsys_mm.clockCrossingAdapter HANDSHAKE
set_interconnect_requirement {$system} qsys_mm.maxAdditionalLatency 1

save_system soc_system.qsys
